# Altium schematic sheet AKS2_Sheet1.SchDoc
size A4
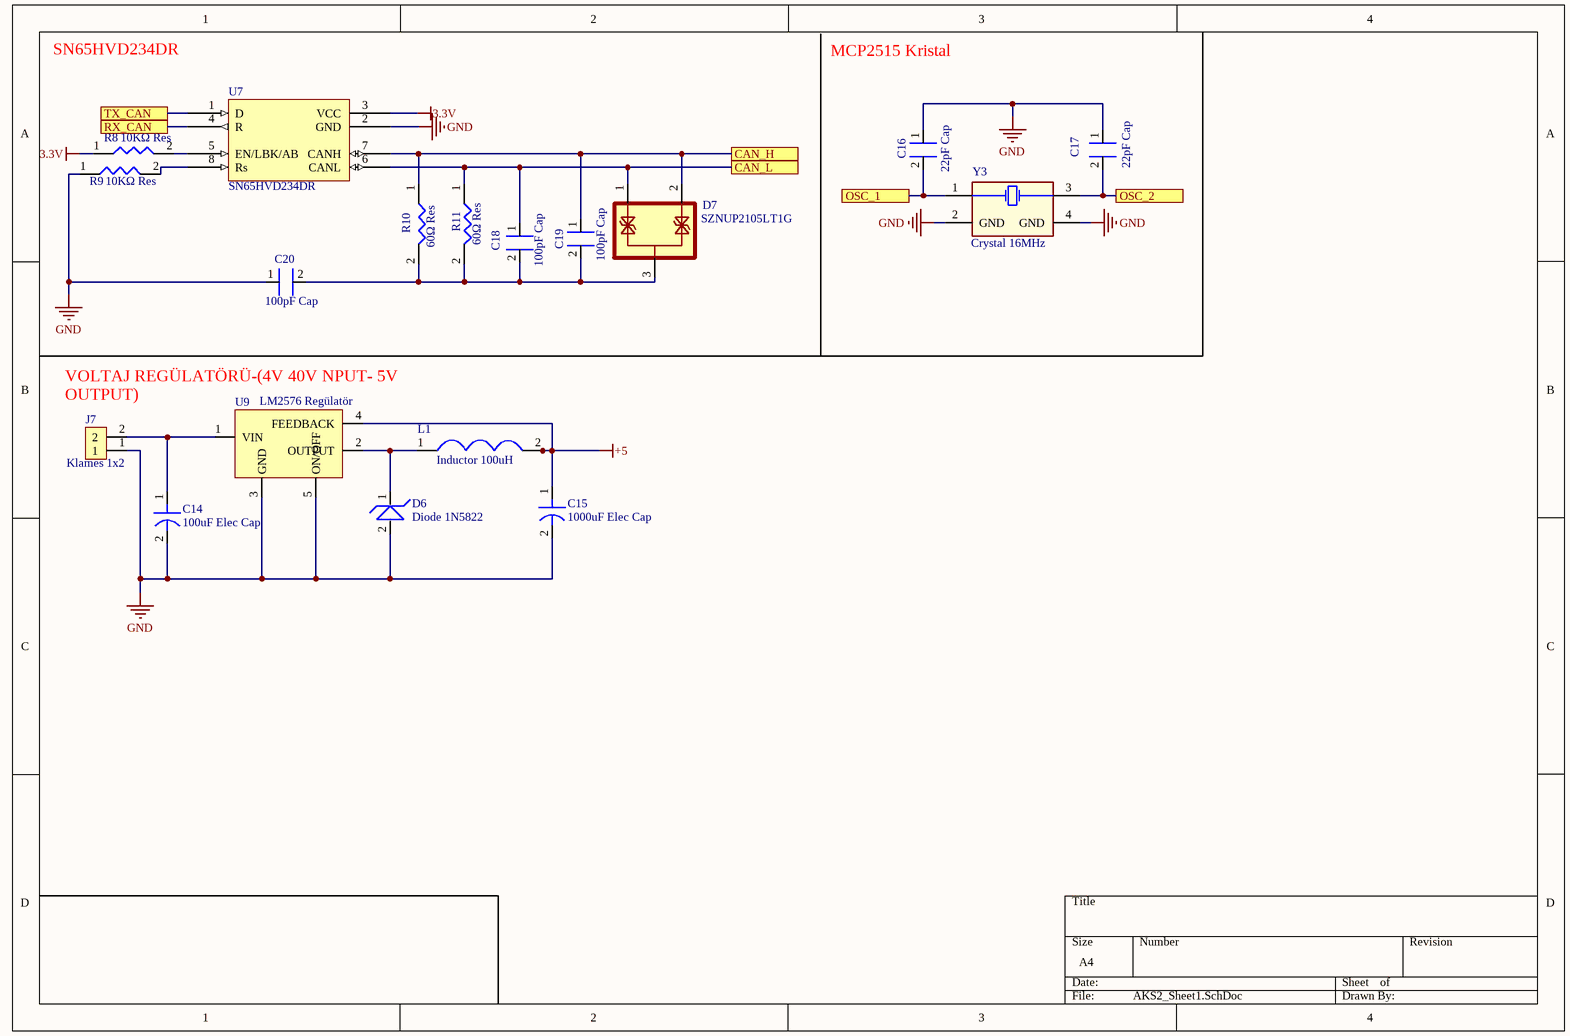
[diagram p0: AKS2_Sheet1.SchDoc]

## Parts
C14  100uF Elec Cap  [100uF -  Elec Cap - CAPAE127P600-8N]
C15  1000uF Elec Cap  [1000uF Elec Cap -  CAPAE127P600-8N]
C16  22pF Cap  [Cap 0603 - 1608]
C17  22pF Cap  [Cap 0603 - 1608]
C18  100pF Cap  [Cap 0603 - 1608]
C19  100pF Cap  [Cap 0603 - 1608]
C20  100pF Cap  [Cap 0603 - 1608]
D6  Diode 1N5822  [Diode - 1N5819]
D7  SZNUP2105LT1G  [SZNUP2105LT1G - SOT23]
J7  Klames 1x2  [Klames 1x2 3.81]
L1  Inductor 100uH  [Inductor]
R8  10KΩ Res  [Res 0603 - 1608]
R9  10KΩ Res  [Res 0603 - 1608]
R10  60Ω Res  [Res 0805 - 2012]
R11  60Ω Res  [Res 0805 - 2012]
U7  SN65HVD234DR  [SN65HVD234DR - SOIC]
U9  LM2576 Regülatör  [LM2576 - TO228P970-3N]
Y3  Crystal 16MHz  [16MHz OSC]

## Ports
CAN_H, CAN_L, OSC_1, OSC_2, RX_CAN, TX_CAN

## Nets
3.3V: R8.1 U7.3(VCC)
+5: C15.1 L1.2 U9.4(FEEDBACK)
GND: C14.2 C15.2 C16.1 C17.1 C20.1 D6.2 J7.1 R9.1 U7.2(GND) U9.3(GND) U9.5(ON/OFF) Y3.2(GND) Y3.4(GND)
CAN_H: C19.1 D7.2 R10.1 U7.7(CANH) ; port CAN_H
CAN_L: C18.1 D7.1 R11.1 U7.6(CANL) ; port CAN_L
OSC_1: C16.2 Y3.1 ; port OSC_1
OSC_2: C17.2 Y3.3 ; port OSC_2
RX_CAN: U7.4(R) ; port RX_CAN
TX_CAN: U7.1(D) ; port TX_CAN
NetC14_1: C14.1 J7.2 U9.1(VIN)
NetC18_2: C18.2 C19.2 C20.2 D7.3 R10.2 R11.2
NetD6_1: D6.1 L1.1 U9.2(OUTPUT)
NetR8_2: R8.2 U7.5(EN/LBK/AB)
NetR9_2: R9.2 U7.8(Rs)

## Notes on the sheet
- SN65HVD234DR
- MCP2515 Kristal
- (near U9) VOLTAJ REGÜLATÖRÜ-(4V 40V NPUT- 5V OUTPUT)

## Library data of the parts
C14 = 100uF Elec Cap: 100uF 50V SMD Elektrolitik Kondansatör 8x10mm 85C; ComponentLink1Description: Satın Alma Linki; ComponentLink1URL: https://www.direnc.net/100uf50v-7x10-smd?language=tr&h=9e593fd0; ComponentLink2Description: Datashhet; ComponentLink2URL: https://cdn.ozdisan.com/ETicaret_Dosya/420197_9090778.pdf
C15 = 1000uF Elec Cap: MRW-016V102MG105-T/R - CAP.EL.1000uF 16V 10x10.5 105C 2000Hrs TB SMD; ComponentLink1Description: Satın Alma Linki; ComponentLink1URL: https://www.ozdisan.com/pasif-komponentler/kondansatorler/aluminyum-kondansatorler/MRW-016V102MG105-TR; ComponentLink2Description: Datasheet; ComponentLink2URL: https://cdn.ozdisan.com/ETicaret_Dosya/420197_9090778.pdf
C16 C17 = 22pF Cap: 100pF Cap 0603 - 1608; ComponentLink1Description: Satın Alma Linki; ComponentLink1URL: https://ozdisan.com/pasif-komponentler/kondansatorler/smt-smd-ve-mlcc-kondansatorler/CL10C220JB8NNNC; ComponentLink2Description: Datashhet; ComponentLink2URL: https://cdn.ozdisan.com/ETicaret_Dosya/484780_3856065.pdf
C18-C20 = 100pF Cap: 100pF Cap 0603 - 1608; ComponentLink1Description: Satın Alma Linki; ComponentLink1URL: https://ozdisan.com/pasif-komponentler/kondansatorler/smt-smd-ve-mlcc-kondansatorler/0603N101J500NT; ComponentLink2Description: Datashhet; ComponentLink2URL: https://cdn.ozdisan.com/ETicaret_Dosya/484780_3856065.pdf
D6 = Diode 1N5822 THT: 1N5822-HT 3.0A Schottky Diyot - MİC; ComponentLink1Description: Satın Alma Linki; ComponentLink1URL: https://www.direnc.net/1n5822-ht-30-amp-schottky-barrier-rectifiers-hottech; ComponentLink2Description: Datasheet; ComponentLink2URL: https://cdn.ozdisan.com/ETicaret_Dosya/417251_1694308.pdf
D7 = SZNUP2105LT1G: SZNUP2105LT1G - DIODE TVS 350W 44VC SOT23 AUTOMOTIVE; ComponentLink1Description: Link; ComponentLink1URL: https://www.ozdisan.com/Product/Detail/462716/SZNUP2105LT1G; ComponentLink2Description: PDF; ComponentLink2URL: https://cdn.ozdisan.com/ETicaret_Dosya/412115_6981582.pdf
J7 = Klames 1x2: 2 Lİ 3,81 MM 90° YEŞİL TAKIM KLEMENS; ComponentLink1Description: Satın Alma Linki; ComponentLink1URL: https://www.hatfon.com/urun/2-li-3-81-mm-90deg-yesil-takim-klemens; ComponentLink2Description: Datasheet; ComponentLink2URL: https://cdn.ozdisan.com/ETicaret_Dosya/404173_7658398.pdf
L1 = Inductor 100uH: RLS-105 - INDUCTOR FIXED 100UH 1.02A 350MOHM SMT; ComponentLink1Description: Satın Alma Linki; ComponentLink1URL: https://www.ozdisan.com/pasif-komponentler/induktorler/sabit-induktorler/RLS-105; ComponentLink2Description: Datasheet; ComponentLink2URL: https://recom-power.com/pdf/Accessories/RLS-105.pdf
R8 R9 = 10KΩ Res: 10KΩ Res 0603 - 1608; ComponentLink1Description: Satın Alma Linki; ComponentLink1URL: https://www.ozdisan.com/pasif-komponentler/direncler/smt-smd-ve-cip-direncler/TC0325B1002T5C; ComponentLink2Description: Datasheet; ComponentLink2URL: https://cdn.ozdisan.com/ETicaret_Dosya/570122_9878629.pdf
R10 R11 = 60Ω Res: 60Ω Res 0603 - 1608; ComponentLink1Description: Satın Alma Linki; ComponentLink1URL: https://www.direnc.net/56r-805-kilif-direnc-100-adet; ComponentLink2Description: Datasheet; ComponentLink2URL: https://cdn.ozdisan.com/ETicaret_Dosya/399380_9872459.pdf
U7 = SN65HVD234DR: SN65HVD234DR - IC-65HVD234 CAN TRANSCEIVER 3.3V 8-SOIC TI; ComponentLink1Description: Satın Alma Linki; ComponentLink1URL: https://ozdisan.com/Product/Detail/409114/SN74LVC1G125DBVR; ComponentLink2Description: Datasheet; ComponentLink2URL: https://cdn.ozdisan.com/ETicaret_Dosya/409114_5931861.pdf
U9 = LM2576 Regülatör: LM2576SX-5.0/NOPB - IC-2576 V.REG.3A 5V SIMPL.STEP-DOWN SMD TO-263 TI /; ComponentLink1Description: Satın Alma Linki; ComponentLink1URL: https://www.ozdisan.com/entegre-devreler-ics/guc-entegreleri/dc-dc-voltaj-regulatorleri/LM2576SX-5-0NOPB; ComponentLink2Description: Datasheet; ComponentLink2URL: https://cdn.ozdisan.com/ETicaret_Dosya/345979_1079437.pdf
Y3 = Crystal 16MHz: ASX5F-16M-FE180C3 - CRYSTAL 16MHZ 18pF 5.0X3.2 SMD XTAL TR; ComponentLink1Description: Satın Alma Linki; ComponentLink1URL: https://www.ozdisan.com/pasif-komponentler/kristaller-osilatorler-ve-rezanatorler/kristaller/ASX5F-16M-FE180C3; ComponentLink2Description: Datasheet; ComponentLink2URL: https://cdn.ozdisan.com/ETicaret_Dosya/428915_5305162.pdf